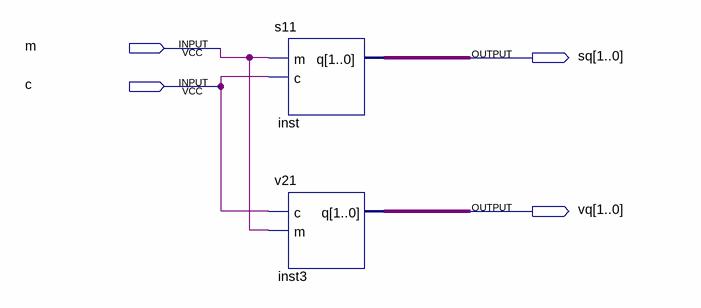
[diagram p0: schematic sheet]
// Quartus schematic sv21.bdf as structural Verilog: 2 symbols, 4 pins
module sv21 (
  input  m,
  input  c,
  output [1:0] sq,
  output [1:0] vq
);

  s11 inst (.m(m), .c(c), .q(sq));
  v21 inst3 (.c(c), .m(m), .q(vq));
endmodule
